# Altium project IV_Array.PrjPcb (part 2 of 2)
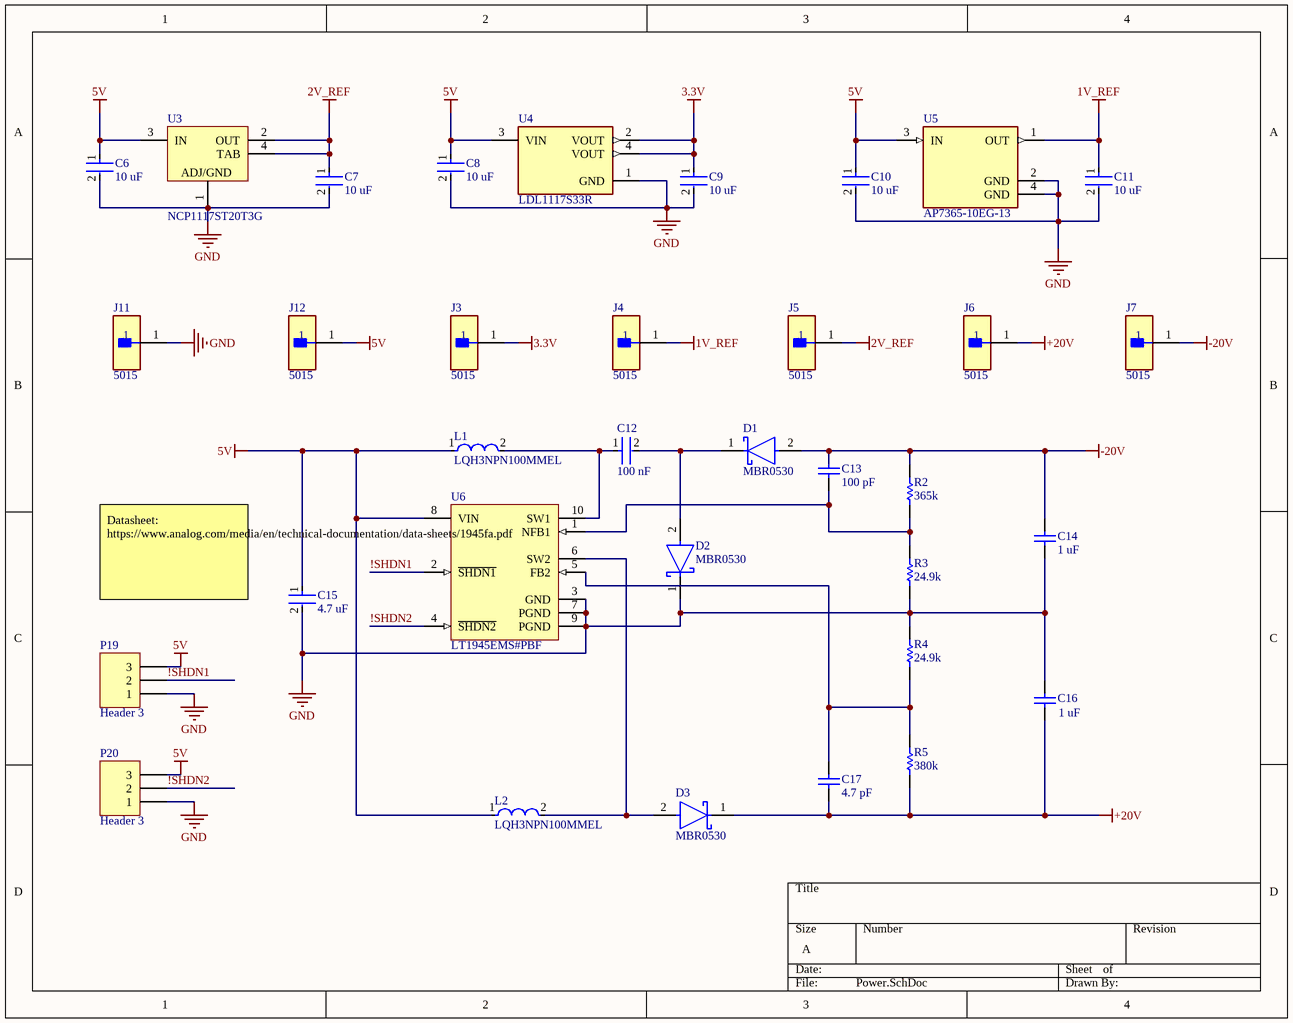
[diagram p6: Power.SchDoc]

## Nets that join several sheets
1V_REF: Connectors (P18.2), Transmit (18 pins), Power (C11.1 J4.1 U5.1)
2V_REF: Connectors (P18.3), ESP32+ADC+DAC (6 pins), Power (C7.1 J5.1 U3.2 U3.4)
3.3V: Connectors (P18.4), ESP32+ADC+DAC (5 pins), Transmit (C26.1 R19.1 U9.13 U9.14), Power (C9.1 J3.1 U4.2 U4.4)
5V: Connectors (P18.5), ESP32+ADC+DAC (P1.1 P2.35), Power (13 pins)
+20V: Connectors (P18.7), Transmit (C18.1 R6.2 U7.8), Power (5 pins)
-20V: Connectors (P18.6), Transmit (C19.1 R8.2 U7.4), Power (5 pins)
GND: Connectors (P18.1), ESP32+ADC+DAC (10 pins), Transmit (15 pins), Power (22 pins)
!DRAIN_EN: ESP32+ADC+DAC (P5.18 P6.10), Transmit (R19.2 U9.22)
DRAIN_SEL0: ESP32+ADC+DAC (P1.7 P2.23), Transmit (U9.15)
DRAIN_SEL1: ESP32+ADC+DAC (P1.6 P2.25), Transmit (U9.16)
DRAIN_SEL2: ESP32+ADC+DAC (P1.8 P2.21), Transmit (U9.17)
DRAIN_SEL3: ESP32+ADC+DAC (P5.26 P6.6), Transmit (U9.18)
DRAIN_SEL4: ESP32+ADC+DAC (P5.20 P6.9), Transmit (U9.19)
GATE1: Connectors (5 pins), Transmit (J13.1 SW7.8)
GATE2: Connectors (5 pins), Transmit (J16.1 SW7.5)
GATE3: Connectors (5 pins), Transmit (J14.1 SW7.2)
GATE4: Connectors (5 pins), Transmit (J17.1 SW7.11)
GATE5: Connectors (J10.5 J19.5 J20.5 P17.5), Transmit (J15.1 SW7.14)
GATE6: Connectors (J10.6 J19.6 J20.6 P17.6), Transmit (J18.1 SW7.17)
VDS1: Connectors (J2.5 J19.7 J20.7), Transmit (U9.12)
VDS2: Connectors (J2.6 J19.8 J20.8), Transmit (U9.11)
VDS3: Connectors (J2.7 J19.9 J20.9), Transmit (U9.10)
VDS4: Connectors (J2.8 J19.10 J20.10), Transmit (U9.9)
VDS5: Connectors (J2.9 J19.11 J20.11), Transmit (U9.8)
VDS6: Connectors (J2.10 J19.12 J20.12), Transmit (U9.7)
VDS7: Connectors (J2.11 J19.13 J20.13), Transmit (U9.6)
VDS8: Connectors (J2.12 J19.14 J20.14), Transmit (U9.5)
VDS9: Connectors (J2.13 J19.15 J20.15), Transmit (U9.4)
VDS10: Connectors (J2.14 J19.16 J20.16), Transmit (U9.3)
VDS11: Connectors (J2.15 J19.17 J20.17), Transmit (U9.2)
VDS12: Connectors (J2.16 J19.18 J20.18), Transmit (U9.1)
VDS13: Connectors (J2.17 J19.19 J20.19), Transmit (U9.48)
VDS14: Connectors (J2.18 J19.20 J20.20), Transmit (U9.47)
VDS15: Connectors (J2.19 J19.21 J20.21), Transmit (U9.46)
VDS16: Connectors (J2.20 J19.22 J20.22), Transmit (U9.45)
VDS17: Connectors (J19.23 J20.23), Transmit (U9.25)
VDS18: Connectors (J19.24 J20.24), Transmit (U9.26)
VDS19: Connectors (J19.25 J20.25), Transmit (U9.27)
VDS20: Connectors (J19.26 J20.26), Transmit (U9.28)
VDS21: Connectors (J19.27 J20.27), Transmit (U9.29)
VDS22: Connectors (J19.28 J20.28), Transmit (U9.30)
VDS23: Connectors (J19.29 J20.29), Transmit (U9.31)
VDS24: Connectors (J19.30 J20.30), Transmit (U9.32)
VDS25: Connectors (J19.31 J20.31), Transmit (U9.33)
VDS26: Connectors (J19.32), Transmit (U9.34)
VDS27: Connectors (J19.33), Transmit (U9.35)
VDS28: Connectors (J19.34), Transmit (U9.36)
VDS29: Connectors (J19.35), Transmit (U9.37)
VDS30: Connectors (J19.36), Transmit (U9.38)
VDS31: Connectors (J19.37), Transmit (U9.39)
VDS32: Connectors (J19.38), Transmit (U9.40)
VDS_RAW: ESP32+ADC+DAC (P10.14), Transmit (U8.5)
VGS_RAW1: ESP32+ADC+DAC (P9.7), Transmit (U10.3)
VGS_RAW2: ESP32+ADC+DAC (P9.9), Transmit (U10.5)
VGS_RAW3: ESP32+ADC+DAC (P9.11), Transmit (U11.3)
VGS_RAW4: ESP32+ADC+DAC (P9.13), Transmit (U11.5)
VGS_RAW5: ESP32+ADC+DAC (P10.12), Transmit (U12.3)
VGS_RAW6: ESP32+ADC+DAC (P10.10), Transmit (U12.5)